# Altium schematic sheet ArduinoUnoShield.SchDoc
size A4
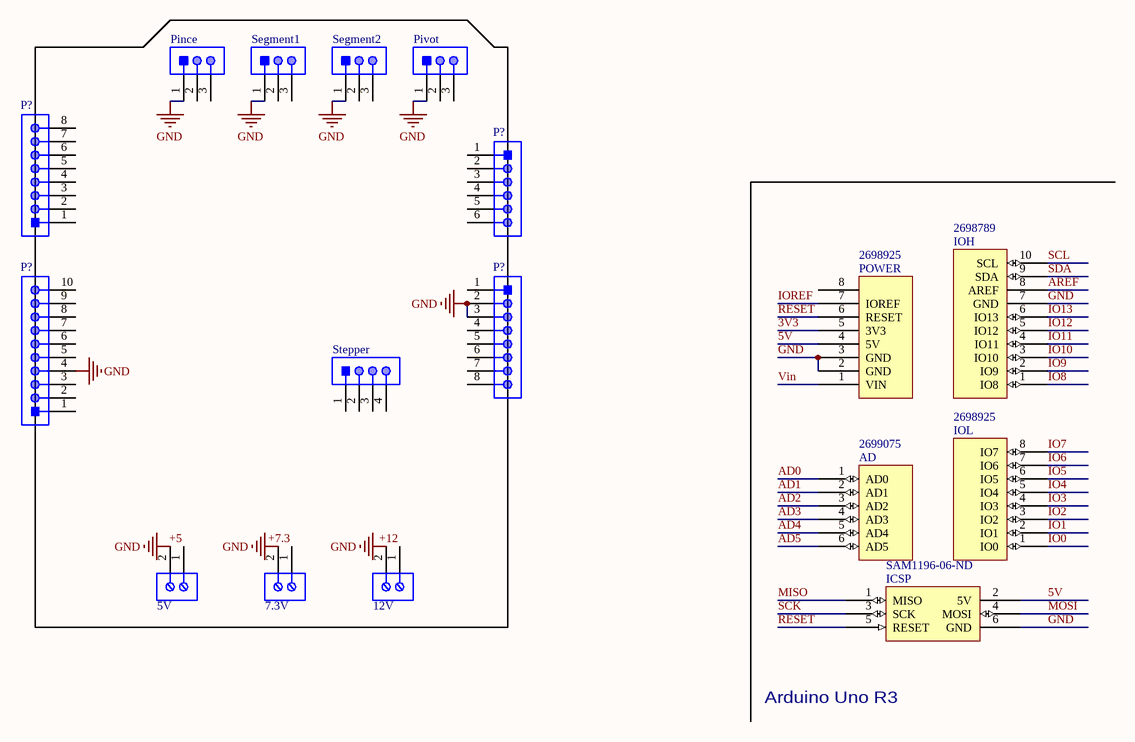
[diagram p0: ArduinoUnoShield.SchDoc]

## Parts
(Parts that share a designator on the sheet are numbered #1, #2 ... from top to bottom, then left to right.)
AD  Supplier Part Number 4: 2699075  [Header 6x1 8.5mm]  (hidden comment: AD)
ICSP  Supplier Part Number 5: SAM1196-06-ND  [ICSP]  (hidden comment: ICSP)
IOH  Supplier Part Number 3: 2698789  [Header 10x1 8.5mm]  (hidden comment: IOH)
IOL  Supplier Part Number 4: 2698925  [Header 8x1 8.5mm]  (hidden comment: IOL)
J1  12V  [691214110002]
J2  7.3V  [691214110002]
J3  5V  [691214110002]
P?#1  61300611121  [61300611121]  (value not drawn)
P?#2  61300811121  [61300811121]  (value not drawn)
P?#3  61300811121  [61300811121]  (value not drawn)
P?#4  61301011021  [61301011021]  (value not drawn)
Pince  71825-3  [TECO-171825-3_V]  (value not drawn)
Pivot  171825-3  [TECO-171825-3_V]  (value not drawn)
POWER  Supplier Part Number 4: 2698925  [Header 8x1 8.5mm]  (hidden comment: POWER_UNO)
Segment1  171825-3  [TECO-171825-3_V]  (value not drawn)
Segment2  171825-3  [TECO-171825-3_V]  (value not drawn)
Stepper  61300411121  [61300411121]  (value not drawn)

## Nets
GND: ICSP.6(GND) IOH.7(GND) J1.2 J2.2 J3.2 P?#3.2 P?#3.3 P?#4.4 Pince.1 Pivot.1 POWER.2(GND) POWER.3(GND) Segment1.1 Segment2.1
3V3: POWER.5(3V3)
5V: ICSP.2(5V) POWER.4(5V)
+5: J3.1
+7.3: J2.1
+12: J1.1
AD0: AD.1(AD0)
AD1: AD.2(AD1)
AD2: AD.3(AD2)
AD3: AD.4(AD3)
AD4: AD.5(AD4)
AD5: AD.6(AD5)
AREF: IOH.8(AREF)
IO0: IOL.1(IO0)
IO1: IOL.2(IO1)
IO2: IOL.3(IO2)
IO3: IOL.4(IO3)
IO4: IOL.5(IO4)
IO5: IOL.6(IO5)
IO6: IOL.7(IO6)
IO7: IOL.8(IO7)
IO8: IOH.1(IO8)
IO9: IOH.2(IO9)
IO10: IOH.3(IO10)
IO11: IOH.4(IO11)
IO12: IOH.5(IO12)
IO13: IOH.6(IO13)
IOREF: POWER.7(IOREF)
MISO: ICSP.1(MISO)
MOSI: ICSP.4(MOSI)
RESET: ICSP.5(RESET) POWER.6(RESET)
SCK: ICSP.3(SCK)
SCL: IOH.10(SCL)
SDA: IOH.9(SDA)
Vin: POWER.1(VIN)

Not connected (* = marked no-connect by the designer): P?#1 1 2 3 4 5 6; P?#2 1 2 3 4 5 6 7 8; P?#3 1 4 5 6 7 8; P?#4 1 2 3 5 6 7 8 9 10; Pince 2 3; Pivot 2 3; POWER 8; Segment1 2 3; Segment2 2 3; Stepper 1 2 3 4

## Notes on the sheet
- Arduino Uno R3

## Library data of the parts
J1-J3 = CMP-1502-02464-1: Serie 2141 - 3.50 mm Horizontal Entry Modular with Rising Cage Clamp WR-TBL, 2 pin; Manufacturer: Wurth Elektronik; Pin Number: 2; Pitch: 3.50mm; Datasheet URL: http://katalog.we-online.de/em/datasheet/6912141100xx.pdf; Packaging: Box; Mounting Technology: THT; Package Reference: 691214110002; Manufacturer URL: http://www.we-online.de; Part Number: 691214110002; Publisher: WurthElektronik; Operating Temperature: -40to105degC
P?#1 = CMP-1502-01070-1: THT Vertical Pin Header WR-PHD, Pitch 2.54 mm, Single Row, 6 pins; Manufacturer: Wurth Elektronik; Gender: Male; Pin Number: 6; Pitch: 2.54mm; Working Voltage: 250VAC; Rated Current: 3A; Withstanding Voltage: 500VAC; Contact Resistance: 20mOhm; Operating Temperature: -40to105degC; Packaging: Bag; Datasheet URL: https://katalog.we-online.de/em/datasheet/6130xx11121.pdf; Package Reference: 61300611121; Mounting Technology: THT; Publisher: WurthElektronik; Part Number: 61300611121; Manufacturer URL: http://www.we-online.de; Row Number: Single; Orientation: Vertical
P?#2 P?#3 = CMP-1502-01076-1: THT Vertical Pin Header WR-PHD, Pitch 2.54 mm, Single Row, 8 pins; Manufacturer: Wurth Elektronik; Rated Current: 3A; Pin Number: 8; Working Voltage: 250VAC; Gender: Male; Contact Resistance: 20mOhm; Pitch: 2.54mm; Withstanding Voltage: 500VAC; Publisher: WurthElektronik; Operating Temperature: -40to105degC; Orientation: Vertical; Row Number: Single; Part Number: 61300811121; Package Reference: 61300811121; Mounting Technology: THT; Packaging: Bag; Manufacturer URL: http://www.we-online.de; Datasheet URL: https://katalog.we-online.de/em/datasheet/6130xx11121.pdf
P?#4 = CMP-1502-01081-1: THT Angled Pin Header WR-PHD, Pitch 2.54 mm, Single Row, 10 pins; Manufacturer: Wurth Elektronik; Contact Resistance: 20mOhm; Pitch: 2.54mm; Gender: Male; Withstanding Voltage: 500VAC; Rated Current: 3A; Working Voltage: 250VAC; Pin Number: 10; Manufacturer URL: http://www.we-online.de; Package Reference: 61301011021; Publisher: WurthElektronik; Part Number: 61301011021; Datasheet URL: https://katalog.we-online.de/em/datasheet/6130xx11021.pdf; Packaging: Bag; Row Number: Single; Orientation: Angled; Mounting Technology: THT; Operating Temperature: -40to105degC
Pince Pivot Segment1 Segment2 = CMP-2000-07494-1: Male Header, Pitch 2.5 mm, 1 x 3 Position, Height 10.4 mm, Tail Length 3.6 mm, / -20 to 95 degC / , RoHS, Bulk; Manufacturer: TE Connectivity; Mating Alignment: Yes(With); Tail Length: 0.142inch; Mating Post Length: 7.5mm; PCB Thickness: 0.063inch; PCB Mount Alignment: No(Without); Voltage Rating: 350V; Max Voltage Rating (AC): 250V; Plating Thickness: 0.8um; PCB Mounting Orientation: Vertical; Number of Positions: 3; PCB Mount Retention: Without; Max Current Rating: 3.5A; Max Voltage Rating (DC): 350.25kV; Pitch: 2.5mm; Approvals: UL; Contact Resistance: 20mOhm; Mount: ThroughHole; Length: 7.5mm; Orientation: Straight; Contact Mating Length: 0.295inch; Contact Material: Brass; Housing Material: Nylon; Package Description: Male Header, Pitch 2.5 mm, 1 x 3 Position, Height 10.4 mm, Tail Length 3.6 mm; Colour: Natural; Backwall/Post Interruptions: No(Without); Min Operating Temperature: -20degC; Mating Retention: Yes(With); Connector Type: Header; Packaging: Bag; RoHSCompliant: True; Package Reference: 171825-3; Contact Shape: Square; Strain Relief: No(Without); Contact Gender: Male; Number of Contacts: 3; Manufacturer URL: http://www.te.com/; Height: 0.409inch; Contact Retention: No(Without); Datasheet Version: Rev. Y3, 12/2016; Panel Mount Retention: No(Without); Datasheet URL: http://www.te.com/commerce/DocumentDelivery/DDEController?Action=showdoc&DocId=Customer+Drawing%7F171825%7FY3%7Fpdf%7FEnglish%7FENG_CD_171825_Y3.pdf%7F171825-3; Termination: Solder; Mounting Technology: ThroughHole; Max Operating Temperature: 95degC; Flammability Rating: UL94V-0; REACH SVHC: NoSVHC; Housing Colour: Natural; Package Quantity: 1000; Number of Rows: 1; Depth: 4.9mm; Contact Plating: Tin
Stepper = CMP-1502-01064-1: THT Vertical Pin Header WR-PHD, Pitch 2.54 mm, Single Row, 4 pins; Manufacturer: Wurth Elektronik; Withstanding Voltage: 500VAC; Rated Current: 3A; Working Voltage: 250VAC; Pin Number: 4; Gender: Male; Contact Resistance: 20mOhm; Pitch: 2.54mm; Manufacturer URL: http://www.we-online.de; Operating Temperature: -40to105degC; Packaging: Bag; Mounting Technology: THT; Package Reference: 61300411121; Datasheet URL: https://katalog.we-online.de/em/datasheet/6130xx11121.pdf; Publisher: WurthElektronik; Part Number: 61300411121; Row Number: Single; Orientation: Vertical
AD = AD: Supplier 1: Arrow; Supplier Part Number 1: 2699089; Supplier 2: Digi-Key; Supplier Part Number 2: SAM1198-06-ND; Supplier 3: Arrow; Supplier Part Number 3: 2699088; Supplier 4: Arrow
ICSP = ICSP: Supplier 1: Arrow; Supplier Part Number 1: 2699117; Supplier 2: Arrow; Supplier Part Number 2: 2699116; Supplier 3: Digi-Key; Supplier Part Number 3: SAM1185-06-ND; Supplier 4: Arrow; Supplier Part Number 4: 2699091; Supplier 5: Digi-Key
IOH = IOH: Supplier 1: Arrow; Supplier Part Number 1: 2698803S4475693N1004; Supplier 2: Digi-Key; Supplier Part Number 2: SAM1198-10-ND; Supplier 3: Arrow
IOL = IOL: Supplier 1: Digi-Key; Supplier Part Number 1: SAM1198-08-ND; Supplier 2: Arrow; Supplier Part Number 2: 2698939; Supplier 3: Arrow; Supplier Part Number 3: 2698940; Supplier 4: Arrow
POWER = POWER_UNO: Supplier 1: Digi-Key; Supplier Part Number 1: SAM1198-08-ND; Supplier 2: Arrow; Supplier Part Number 2: 2698939; Supplier 3: Arrow; Supplier Part Number 3: 2698940; Supplier 4: Arrow